# Altium schematic sheet ConectoresEntrada.SchDoc
size 355 x 254 mm; DrawnBy: Constanza Barriga
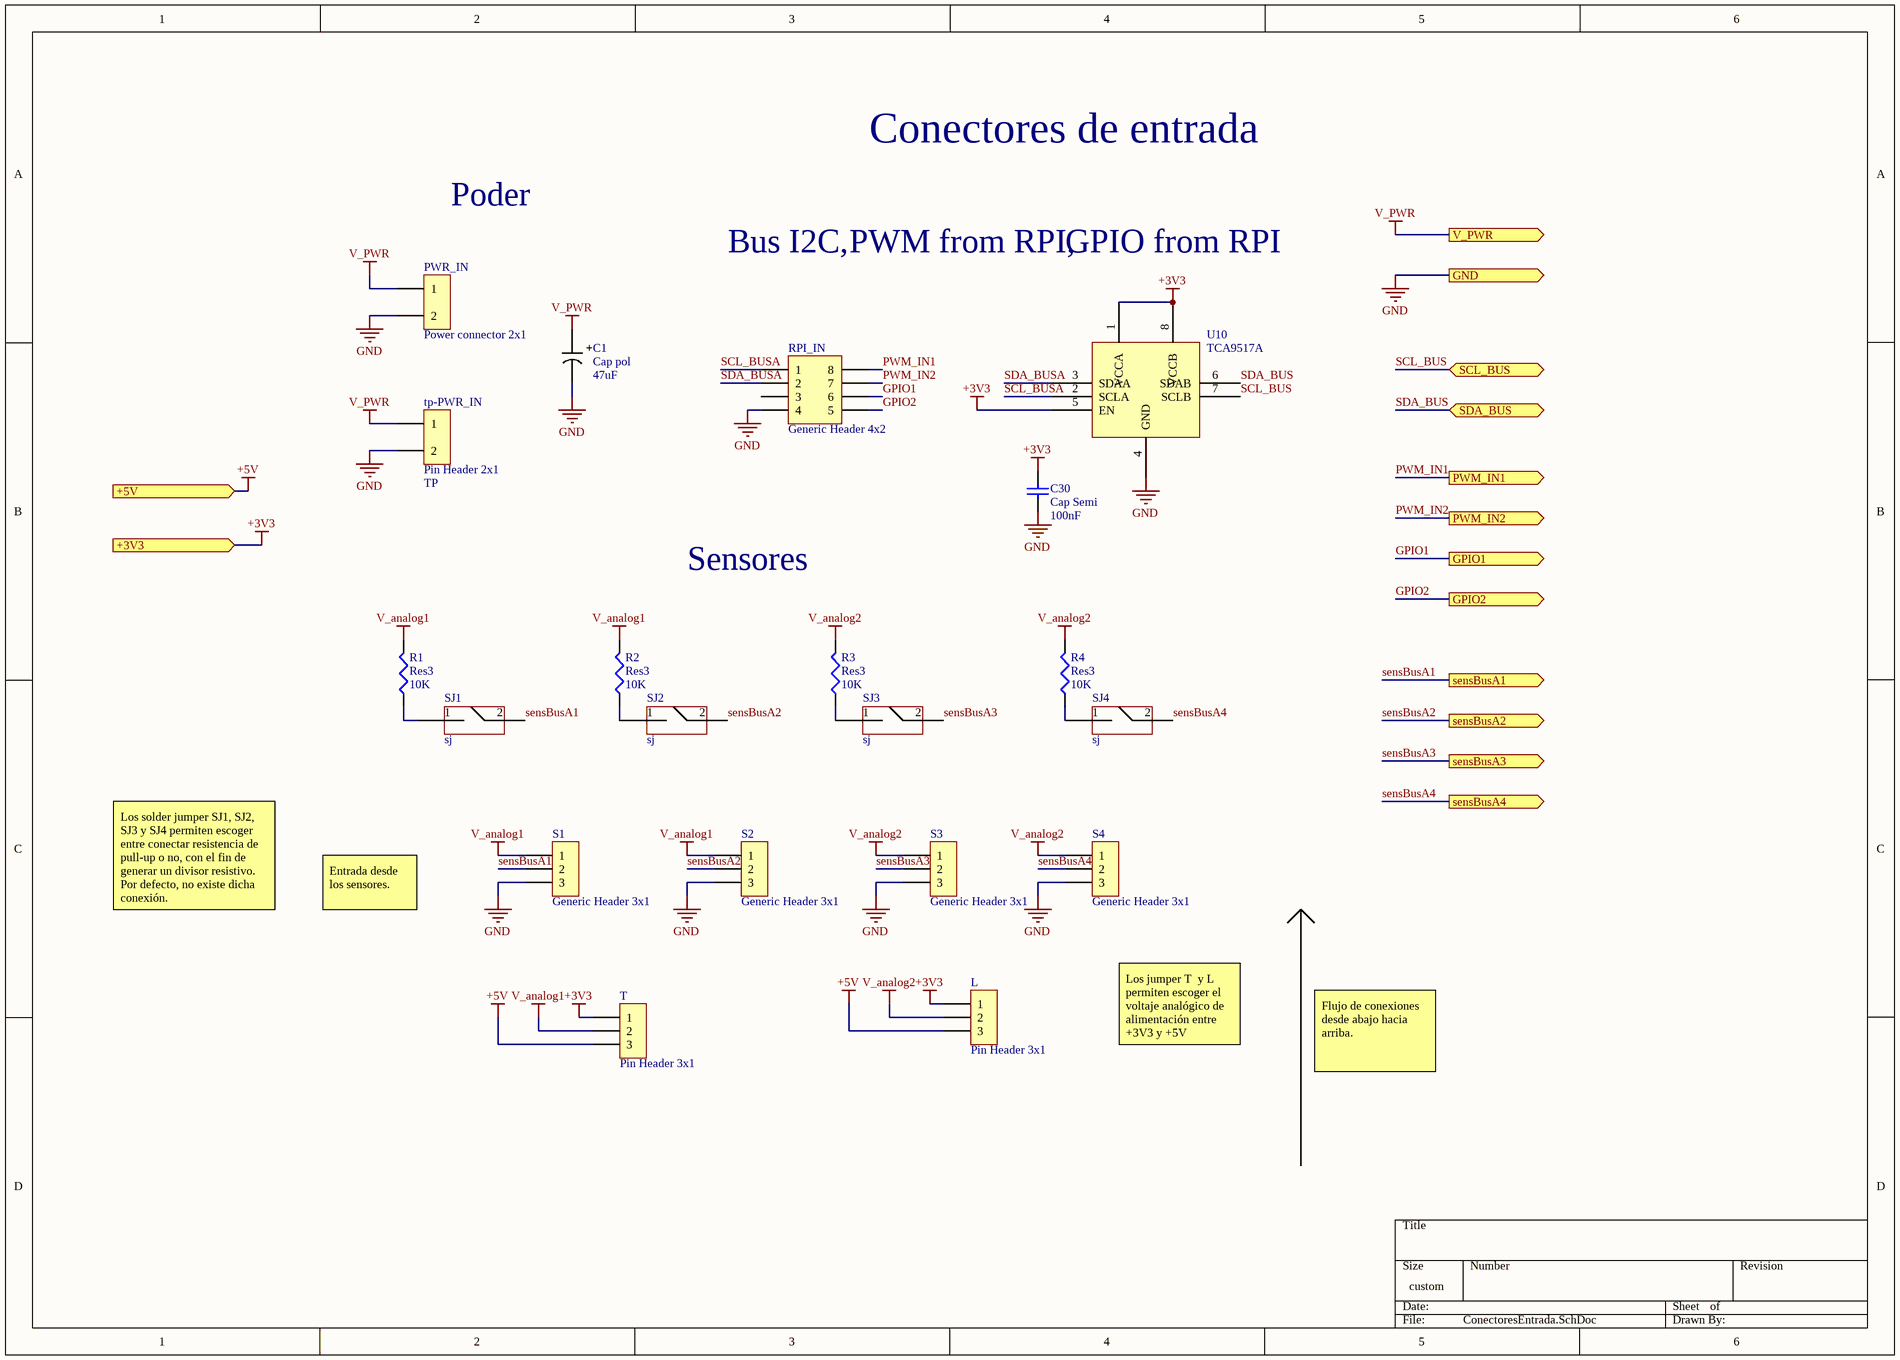
[diagram p0: ConectoresEntrada.SchDoc]

## Parts
C1  Cap pol  value 47uF  [CAP_SMD_Electrolytic_10x10]
C30  Cap Semi  value 100nF  [1608[0603]]
L  Pin Header 3x1  [HDR-TH_3P-P2.54-V]
PWR_IN  Power connector 2x1  [CONN-TH_430450212]
R1  Res3  value 10K  [J1-0603]
R2  Res3  value 10K  [J1-0603]
R3  Res3  value 10K  [J1-0603]
R4  Res3  value 10K  [J1-0603]
RPI_IN  Generic Header 4x2  [CONN-TH_8P-P2.54-V-M_15477608]
S1  Generic Header 3x1  [CONN-TH_A2547WV-3P]
S2  Generic Header 3x1  [CONN-TH_A2547WV-3P]
S3  Generic Header 3x1  [CONN-TH_A2547WV-3P]
S4  Generic Header 3x1  [CONN-TH_A2547WV-3P]
SJ1  sj  [SJ2]
SJ2  sj  [SJ2]
SJ3  sj  [SJ2]
SJ4  sj  [SJ2]
T  Pin Header 3x1  [HDR-TH_3P-P2.54-V]
tp-PWR_IN  Pin Header 2x1  [HDR-TH_P2.54-H-M_A2541WV-2P]
U10  TCA9517A  [VSSOP - 8]

## Ports
+3V3 (in), +5V (in), GND (out), GPIO1 (out), GPIO2 (out), PWM_IN1 (out), PWM_IN2 (out), SCL_BUS (bidir), SDA_BUS (bidir), sensBusA1 (out), sensBusA2 (out), sensBusA3 (out), sensBusA4 (out), V_PWR (out)

## Nets
+3V3: C30.2 L.1 T.1 U10.1(VCCA) U10.5(EN) U10.8(VCCB) ; port +3V3
+5V: L.3 T.3 ; port +5V
GND: C1.1 C30.1 PWR_IN.2 RPI_IN.4 S1.3 S2.3 S3.3 S4.3 tp-PWR_IN.2 U10.4(GND) ; port GND
V_analog1: R1.2 R2.2 S1.1 S2.1 T.2
V_analog2: L.2 R3.2 R4.2 S3.1 S4.1
V_PWR: C1.2 PWR_IN.1 tp-PWR_IN.1 ; port V_PWR
GPIO1: RPI_IN.6 ; port GPIO1
GPIO2: RPI_IN.5 ; port GPIO2
PWM_IN1: RPI_IN.8 ; port PWM_IN1
PWM_IN2: RPI_IN.7 ; port PWM_IN2
SCL_BUS: U10.7(SCLB) ; port SCL_BUS
SCL_BUSA: RPI_IN.1 U10.2(SCLA)
SDA_BUS: U10.6(SDAB) ; port SDA_BUS
SDA_BUSA: RPI_IN.2 U10.3(SDAA)
sensBusA1: S1.2 SJ1.2 ; port sensBusA1
sensBusA2: S2.2 SJ2.2 ; port sensBusA2
sensBusA3: S3.2 SJ3.2 ; port sensBusA3
sensBusA4: S4.2 SJ4.2 ; port sensBusA4
NetR1_1: R1.1 SJ1.1
NetR2_1: R2.1 SJ2.1
NetR3_1: R3.1 SJ3.1
NetR4_1: R4.1 SJ4.1

Not connected (* = marked no-connect by the designer): RPI_IN 3

## Notes on the sheet
- Conectores de entrada
- Poder
- Bus I2C,
- PWM from RPI,
- GPIO from RPI
- (near tp-PWR_IN) TP
- Sensores
- Los solder jumper SJ1, SJ2, SJ3 y SJ4 permiten escoger entre conectar resistencia de pull-up o no, con el fin de generar un divisor resistivo. Por defecto, no existe dicha conexión.
- Entrada desde los sensores.
- Los jumper T  y L permiten escoger el voltaje analógico de alimentación entre +3V3 y +5V
- Flujo de conexiones desde abajo hacia arriba.
- (in symbol Cap pol) +

## Library data of the parts
C1 = Cap pol: Electrolytic Aluminium Capacitor; Manufacturer: Lelon; Manufacturer Part Number: VEJ470M1HTR-1010; Voltage: 50V; Supplier 1: LCSC; Supplier Part Number 1: C249662; Package: SMD,10x10mm
C30 = Cap Semi: Capacitor (Semiconductor SIM Model); Manufacturer: Taiyo Yuden; Manufacturer Part Number: UMK107B104KAHT; Published: 8-Jun-2000; LatestRevisionDate: 29-May-2009; LatestRevisionNote: IPC-7351 Footprint Added.; PackageReference: C0603; Publisher: Altium Limited; PackageDescription: Chip Capacitor; Supplier 1: LCSC; Supplier Part Number 1: C386152
L T = Header - 3x1c: Pin Header 3pos, 1 row, 2.54 pitch; Manufacturer: CJT(Changjiang Connectors); Manufacturer Part Number: A2541WV-3P; Pitch: 2.54; Supplier 1: LCSC; Supplier Part Number 1: C225478
PWR_IN = PC - 2X1: Generic Header Power 2pos; Manufacturer: MOLEX; Manufacturer Part Number: 430450212; Supplier 1: LCSC; Supplier Part Number 1: C293362; Package: *
R1 R3 = Res3: Resistor; Manufacturer: PANASONIC; Manufacturer Part Number: ERJPB3B1002V; Published: 8-Jun-2000; LatestRevisionDate: 29-May-2009; LatestRevisionNote: IPC-7351 Footprint Added.; PackageReference: J1-0603; Publisher: Altium Limited; PackageDescription: Chip Resistor; Supplier 1: LCSC; Supplier Part Number 1: C161787
R2 = Res3: Resistor; Manufacturer: PANASONIC; Manufacturer Part Number: ERJPB3B1002V; Rule: PcbType=ProtelPcb; Published: 8-Jun-2000; LatestRevisionDate: 29-May-2009; LatestRevisionNote: IPC-7351 Footprint Added.; PackageReference: J1-0603; Publisher: Altium Limited; PackageDescription: Chip Resistor; Supplier 1: LCSC; Supplier Part Number 1: C161787
R4 = Res3: Resistor; Manufacturer Part Number: ERJPB3B1002V; Manufacturer: PANASONIC; Published: 8-Jun-2000; LatestRevisionDate: 29-May-2009; LatestRevisionNote: IPC-7351 Footprint Added.; PackageReference: J1-0603; Publisher: Altium Limited; PackageDescription: Chip Resistor; Supplier Part Number 1: C161787; Supplier 1: LCSC
RPI_IN = Header - 4x2: Generic Header 8 pos, 2 row, 2.54 pitch; Manufacturer: MOLEX; Manufacturer Part Number: 15477608; Pitch: 2.54; Package: Through Hole,P=2.54mm; Supplier 1: LCSC; Supplier part number 1: C277394
S1-S4 = Header - 3x1: Generic Header 3pos, 1 row, 2.54 pitch; Manufacturer: CJT(Changjiang Connectors); Manufacturer Part Number: A2547WV-3P; Pitch: 2.54; Supplier 1: LCSC; Supplier Part Number 1: C239378; Package: Through Hole,P=2.54mm
SJ1-SJ4 = Jumper: solder jumper generic
tp-PWR_IN = Header - 2x1c: Pin Header 2pos, 1 row, 2.54 pitch; Manufacturer: CJT(Changjiang Connectors); Manufacturer Part Number: A2541WV-2P; Pitch: 2.54; Supplier 1: LCSC; Supplier Part Number 1: C225477
U10 = TCA9517A: VSSOP-8_3x3x065P Level Translators, Shifters RoHS; Manufacturer: Texas Instruments; Manufacturer Part Number: TCA9517ADGKR; Supplier 1: LCSC; Supplier Part Number 1: C201698